# Altium schematic sheet 3.3V_Regulator.SchDoc
size A4; SheetNumber: 2; SheetTotal: 13
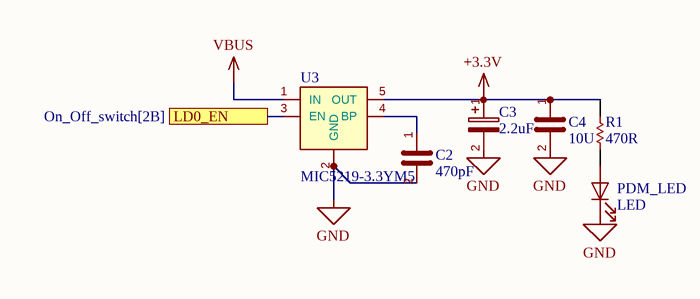
[diagram p0: 3.3V_Regulator.SchDoc]

## Parts
C2  470pF  [CAPC2013X70X45NL10T25]
C3  2.2uF  [Elco capacitor]
C4  10U  [CAPC2013X70X45NL10T25]
PDM_LED  LED  [LEDC2012X70N]
R1  470R  [RESC2013X70X40NL20T20]
U3  MIC5219-3.3YM5  [FP-SOT23-5LD-PL-1-MFG]

## Ports
LD0_EN (see On_Off_switch[2B])

## Nets
+3.3V: C3.1 C4.1 R1.1 U3.5(OUT)
GND: C2.2 C3.2 C4.2 PDM_LED.C U3.2(GND)
VBUS: U3.1(IN)
LD0_EN: U3.3(EN) ; port LD0_EN
NetC2_1: C2.1 U3.4(BP)
NetPDM_LED_A: PDM_LED.A R1.2

## Library data of the parts
C2 C4 = C
C3 = C_Polarized
R1 = CMP-2100-03671-1: Chip Resistor, 1 KOhm, +/- 1%, 125 mW, -55 to 155 degC, 0805 (2012 Metric), RoHS, Tape and Reel; Manufacturer: Yageo; Temperature Coefficient: 100ppm/degreesC; Voltage Rating (DC): 150V; Max Power Dissipation: 125mW; Resistance: 1KOhm; Number of Pins: 2; Number of Terminations: 2; Datasheet URL: http://www.yageo.com/NewPortal/yageodocoutput?fileName=/pdf/R-Chip/PYu-RC_Group_51_RoHS_L_5.pdf; Length: 0.079inch; Package Description: 2-Pin Surface Mounted Device, Body 2 x 1.25 mm; Depth: 1.25mm; Height: 0.024inch; Military Standard: Not; Case/Package: 0805; Package Reference: 0805; RoHSCompliant: true; Lead Free: LeadFree; Packaging: TapeandReel; Package Quantity: 1; Datasheet Version: Rev. 5, 10/2016; Tolerance: 1%; Min Operating Temperature: -55degC; Voltage Rating: 150V; Composition: ThickFilm; Case Code (Imperial): 0805; Power Rating: 125mW; Width: 0.049inch; Case Code (Metric): 2012; Manufacturer URL: http://www.yageo.com/; Max Operating Temperature: 155degC; REACH SVHC: Unknown; Termination: SMD/SMT